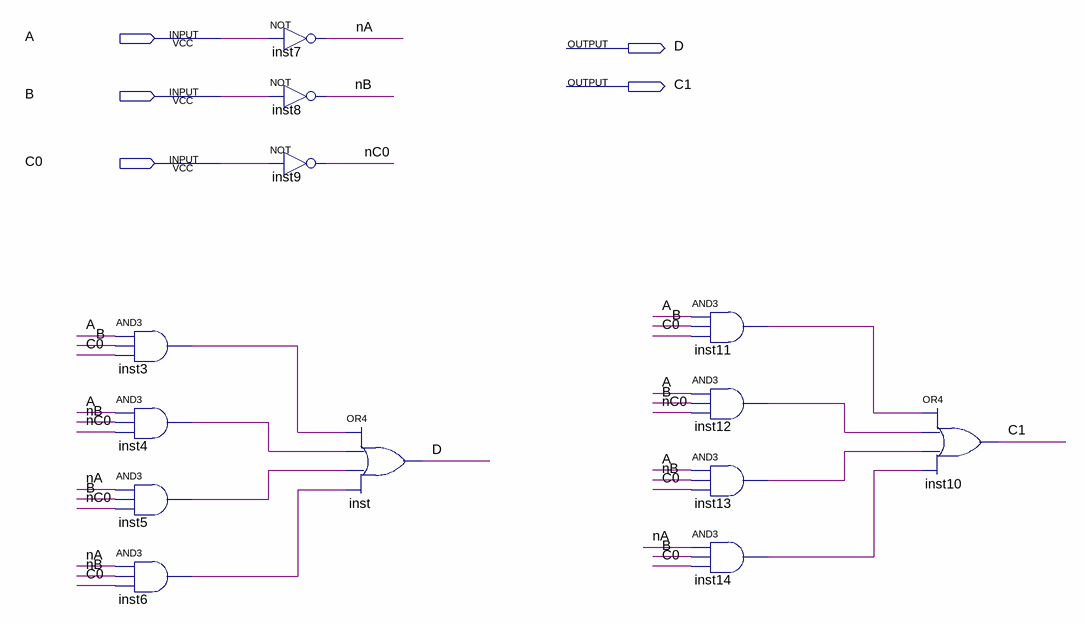
[diagram p0: schematic sheet]
// Quartus schematic ADD1.bdf as structural Verilog: 13 symbols, 5 pins
module ADD1 (
  input  A,
  input  B,
  input  C0,
  output D,
  output C1
);

  wire inst3_out, inst4_out, inst5_out, inst6_out, inst11_out, inst12_out, inst13_out, inst14_out, nA, nB,
       nC0;

  and inst3 (inst3_out, A, B, C0);
  and inst4 (inst4_out, A, nB, nC0);
  and inst5 (inst5_out, nA, B, nC0);
  and inst6 (inst6_out, nA, nB, C0);
  not inst7 (nA, A);
  not inst8 (nB, B);
  not inst9 (nC0, C0);
  or inst (D, inst3_out, inst4_out, inst5_out, inst6_out);
  and inst11 (inst11_out, A, B, C0);
  and inst12 (inst12_out, A, B, nC0);
  and inst13 (inst13_out, A, nB, C0);
  and inst14 (inst14_out, nA, B, C0);
  or inst10 (C1, inst11_out, inst12_out, inst13_out, inst14_out);
endmodule
